# EAGLE schematic TheRightHandPath (EAGLE 9.6.0)

## Sheet 1 of 2
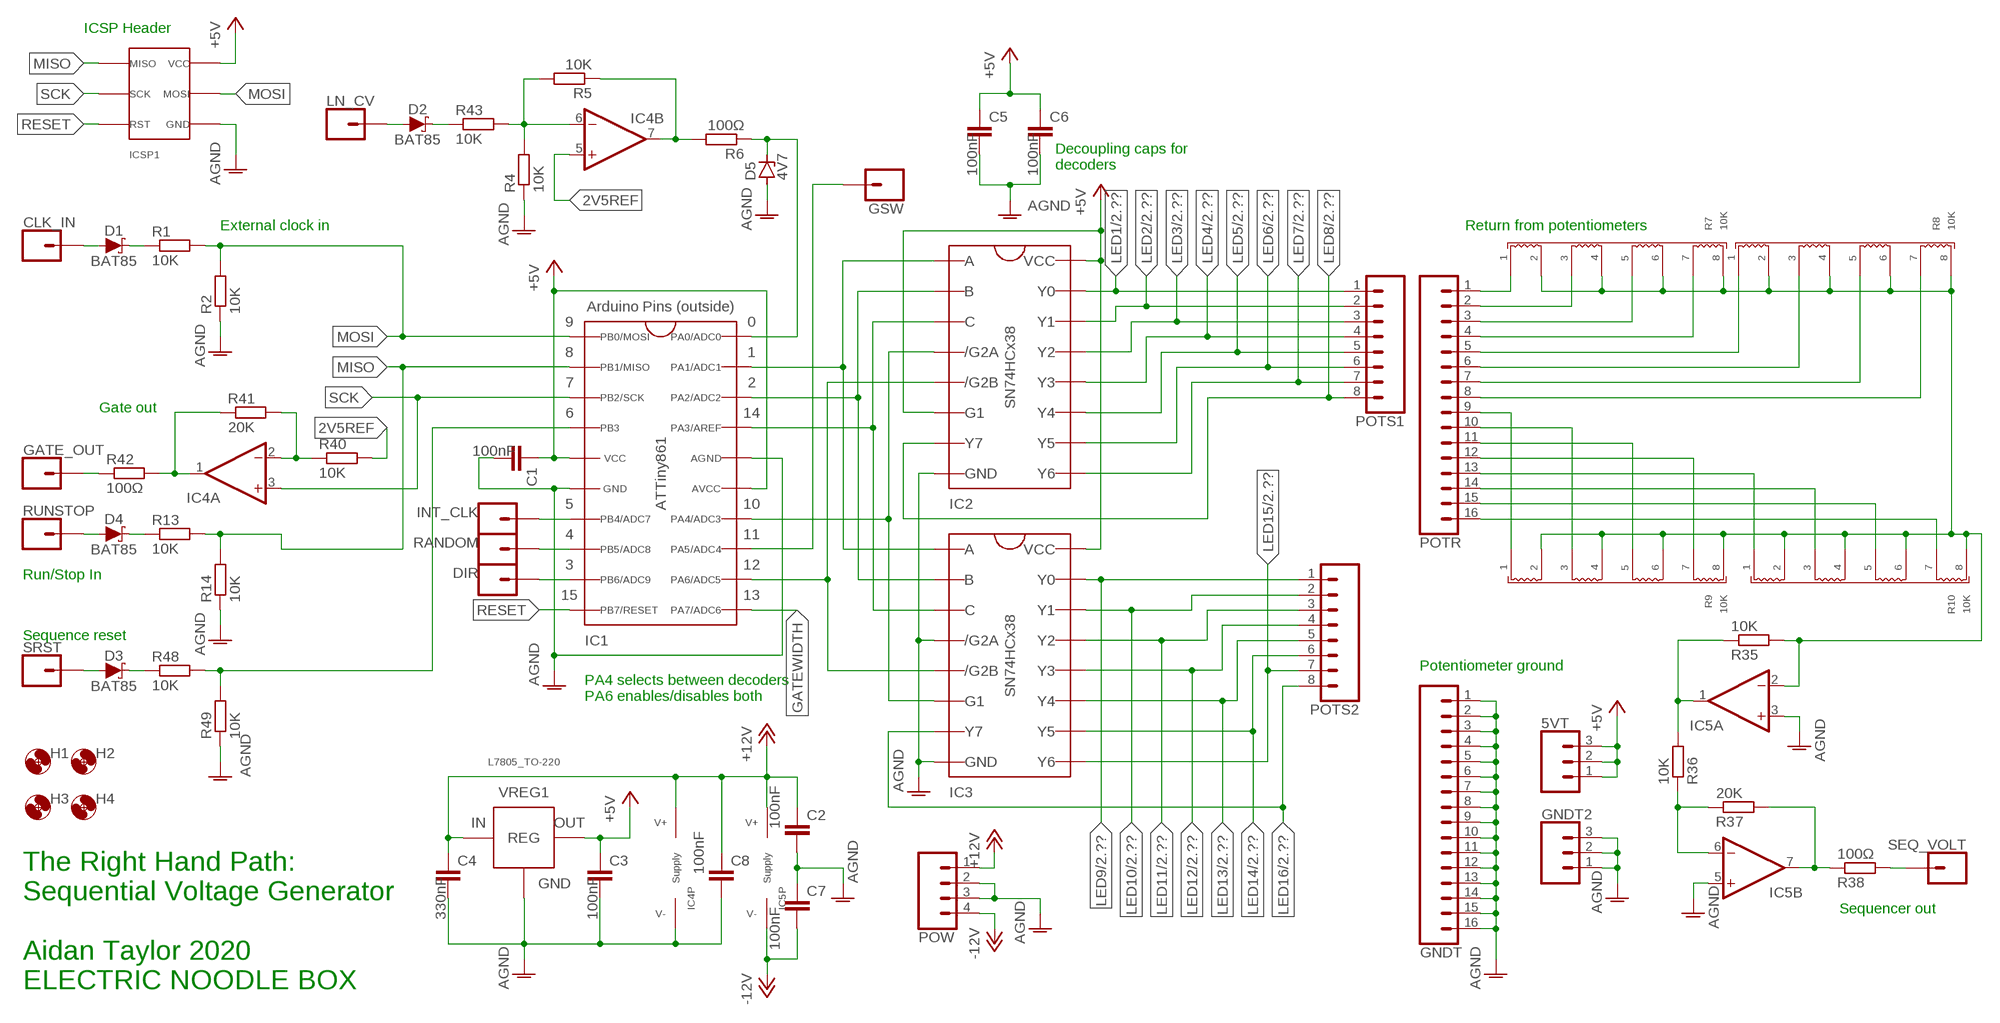
[diagram p0: schematic, sheet 1]

### Parts
5VT  3XWIREPAD  [1X03]
C1  100nF  C-EU050-025X075  [C050-025X075]
C2  100nF  C-EU050-025X075  [C050-025X075]
C3  100nF  C-EU050-025X075  [C050-025X075]
C4  330nF  C-EU050-025X075  [C050-025X075]
C5  100nF  C-EU050-025X075  [C050-025X075]
C6  100nF  C-EU050-025X075  [C050-025X075]
C7  100nF  C-EU050-025X075  [C050-025X075]
C8  100nF  C-EU050-025X075  [C050-025X075]
CLK_IN  1XWIREPAD  [1X01]
D1  BAT85  SCHOTTKY_DO35  [DO35-7]
D2  BAT85  SCHOTTKY_DO35  [DO35-7]
D3  BAT85  SCHOTTKY_DO35  [DO35-7]
D4  BAT85  SCHOTTKY_DO35  [DO35-7]
D5  4V7  ZENER-DIODEDO35Z10  [DO35Z10]
DIR  1XWIREPAD  [1X01]
GATE_OUT  1XWIREPAD  [1X01]
GNDT  16XWIREPAD  [1X16]
GNDT2  3XWIREPAD  [1X03]
GSW  1XWIREPAD  [1X01]
H1  MOUNT-HOLE3.2  [3,2]
H2  MOUNT-HOLE3.2  [3,2]
H3  MOUNT-HOLE3.2  [3,2]
H4  MOUNT-HOLE3.2  [3,2]
IC1  ATTINY861_DIP  [DIL20]
IC2  SN74HCX38  [DIL16]
IC3  SN74HCX38  [DIL16]
IC4  LM358_DIP  [DIL08]
IC5  TL0X2_DIP  [DIL08]
ICSP1  ICSP_2.54  [2X3]
INT_CLK  1XWIREPAD  [1X01]
LN_CV  1XWIREPAD  [1X01]
POTR  16XWIREPAD  [1X16]
POTS1  8XWIREPAD  [1X08]
POTS2  8XWIREPAD  [1X08]
POW  4XMOLEX  [MOLEX-1X4]
R1  10K  R-EU_0207/10  [0207/10]
R2  10K  R-EU_0207/10  [0207/10]
R4  10K  R-EU_0207/10  [0207/10]
R5  10K  R-EU_0207/10  [0207/10]
R6  100Ω  R-EU_0207/10  [0207/10]
R7  10K  4XISO_RESISTOR_NETWORK_2.54  [4_ISO_RES_NET_2.54]
R8  10K  4XISO_RESISTOR_NETWORK_2.54  [4_ISO_RES_NET_2.54]
R9  10K  4XISO_RESISTOR_NETWORK_2.54  [4_ISO_RES_NET_2.54]
R10  10K  4XISO_RESISTOR_NETWORK_2.54  [4_ISO_RES_NET_2.54]
R13  10K  R-EU_0207/10  [0207/10]
R14  10K  R-EU_0207/10  [0207/10]
R35  10K  R-EU_0207/10  [0207/10]
R36  10K  R-EU_0207/10  [0207/10]
R37  20K  R-EU_0207/10  [0207/10]
R38  100Ω  R-EU_0207/10  [0207/10]
R40  10K  R-EU_0207/10  [0207/10]
R41  20K  R-EU_0207/10  [0207/10]
R42  100Ω  R-EU_0207/10  [0207/10]
R43  10K  R-EU_0207/10  [0207/10]
R48  10K  R-EU_0207/10  [0207/10]
R49  10K  R-EU_0207/10  [0207/10]
RANDOM  1XWIREPAD  [1X01]
RUNSTOP  1XWIREPAD  [1X01]
SEQ_VOLT  1XWIREPAD  [1X01]
SRST  1XWIREPAD  [1X01]
VREG1  L7805_TO-220  [TO220H]

### Nets
2V5REF: IC4.5(B:+IN) R40.2
+5V: 5VT.1 5VT.2 5VT.3 C1.1 C3.1 C5.1 C6.1 IC1.5(VCC) IC1.15(AVCC) IC2.6(6_G1) IC2.16(16_VCC) IC3.16(16_VCC) ICSP1.2(6VCC) VREG1.3(VOUT) ; also sheet 2
+12V: C2.1 C4.1 C8.1 IC4.8(P:V+) IC5.8(P:V+) POW.1 VREG1.1(VIN)
-12V: C7.2 IC5.4(P:V-) POW.4
AGND: C1.2 C2.2 C3.2 C4.2 C5.2 C6.2 C7.1 C8.2 D5.A GNDT2.1 GNDT2.2 GNDT2.3 GNDT.1 GNDT.2 GNDT.3 GNDT.4 GNDT.5 GNDT.6 GNDT.7 GNDT.8 GNDT.9 GNDT.10 GNDT.11 GNDT.12 GNDT.13 GNDT.14 GNDT.15 GNDT.16 IC1.6(GND) IC1.16(AGND) IC2.8(8_GND) IC3.4(4_/G2A) IC3.8(8_GND) IC4.4(P:V-) IC5.3(A:+IN) IC5.5(B:+IN) ICSP1.6(4GND) POW.2 POW.3 R2.1 R4.1 R14.1 R49.1 VREG1.2(GND) ; also sheet 2
GATEWIDTH: IC1.11(11_PA7)
LED1: IC2.15(15_Y0) POTS1.1 ; also sheet 2
LED2: IC2.14(14_Y1) POTS1.2 ; also sheet 2
LED3: IC2.13(13_Y2) POTS1.3 ; also sheet 2
LED4: IC2.12(12_Y3) POTS1.4 ; also sheet 2
LED5: IC2.11(11_Y4) POTS1.5 ; also sheet 2
LED6: IC2.10(10_Y5) POTS1.6 ; also sheet 2
LED7: IC2.9(9_Y6) POTS1.7 ; also sheet 2
LED8: IC2.7(7_Y7) POTS1.8 ; also sheet 2
LED9: IC3.15(15_Y0) POTS2.1 ; also sheet 2
LED10: IC3.14(14_Y1) POTS2.2 ; also sheet 2
LED11: IC3.13(13_Y2) POTS2.3 ; also sheet 2
LED12: IC3.12(12_Y3) POTS2.4 ; also sheet 2
LED13: IC3.11(11_Y4) POTS2.5 ; also sheet 2
LED14: IC3.10(10_Y5) POTS2.6 ; also sheet 2
LED15: IC3.9(9_Y6) POTS2.7 ; also sheet 2
LED16: IC3.7(7_Y7) POTS2.8 ; also sheet 2
MISO: IC1.2(2_PB1) ICSP1.1(1MISO) R13.2 R14.2
MOSI: IC1.1(1_PB0) ICSP1.4(5MOSI) R1.2 R2.2
N$1: IC1.14(14_PA4) IC2.4(4_/G2A) IC3.6(6_G1)
N$2: IC1.17(17_PA3) IC2.3(3_C) IC3.3(3_C)
N$3: IC1.18(18_PA2) IC2.2(2_B) IC3.2(2_B)
N$4: IC1.19(19_PA1) IC2.1(1_A) IC3.1(1_A)
N$5: D4.A RUNSTOP.1
N$6: GSW.1 IC1.13(13_PA5)
N$8: CLK_IN.1 D1.A
N$9: D1.C R1.1
N$11: IC1.7(7_PB4) INT_CLK.1
N$13: IC1.12(12_PA6) IC2.5(5_/G2B) IC3.5(5_/G2B)
N$15: IC4.7(B:OUT) R5.1 R6.2
N$17: D5.C IC1.20(20_PA0) R6.1
N$42: POTR.1 R7.P$1
N$43: POTR.2 R7.P$3
N$44: POTR.3 R7.P$5
N$45: POTR.4 R7.P$7
N$46: POTR.5 R8.P$1
N$47: POTR.6 R8.P$3
N$48: POTR.7 R8.P$5
N$49: POTR.8 R8.P$7
N$50: POTR.9 R9.P$1
N$51: POTR.10 R9.P$3
N$52: POTR.11 R9.P$5
N$53: POTR.12 R9.P$7
N$54: POTR.13 R10.P$1
N$55: POTR.14 R10.P$3
N$56: POTR.15 R10.P$5
N$57: POTR.16 R10.P$7
N$58: IC5.2(A:-IN) R7.P$2 R7.P$4 R7.P$6 R7.P$8 R8.P$2 R8.P$4 R8.P$6 R8.P$8 R9.P$2 R9.P$4 R9.P$6 R9.P$8 R10.P$2 R10.P$4 R10.P$6 R10.P$8 R35.2
N$59: IC5.1(A:OUT) R35.1 R36.2
N$60: IC5.6(B:-IN) R36.1 R37.1
N$61: R38.2 SEQ_VOLT.1
N$62: IC5.7(B:OUT) R37.2 R38.1
N$63: IC4.2(A:-IN) R40.1 R41.2
N$64: GATE_OUT.1 R42.1
N$65: IC4.1(A:OUT) R41.1 R42.2
N$66: D2.C R43.1
N$67: IC4.6(B:-IN) R4.2 R5.2 R43.2
N$71: D2.A LN_CV.1
N$73: IC1.8(8_PB5) RANDOM.1
N$74: DIR.1 IC1.9(9_PB6)
N$75: D3.A SRST.1
N$76: D3.C R48.1
N$77: IC1.4(4_PB3) R48.2 R49.2
N$80: D4.C R13.1
RESET: IC1.10(10_PB7) ICSP1.5(3RST)
SCK: IC1.3(3_PB2) IC4.3(A:+IN) ICSP1.3(2SCK)

### Notes on the sheet
- ICSP Header
- Decoupling caps for
  decoders
- External clock in | Return from potentiometers
- Gate out
- Run/Stop In
- Sequence reset
- Potentiometer ground
- PA4 selects between decoders
  PA6 enables/disables both
- Sequencer out
- The Right Hand Path:
  Sequential Voltage Generator
  
  Aidan Taylor 2020
  ELECTRIC NOODLE BOX

## Sheet 2 of 2
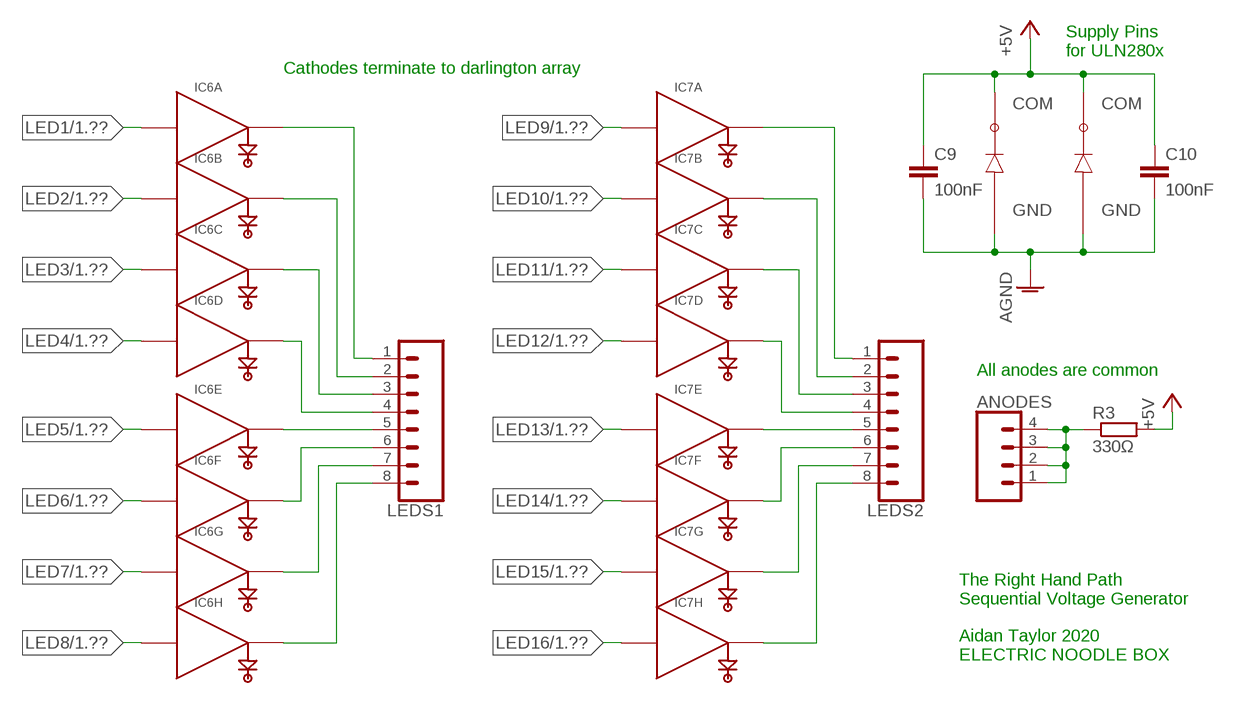
[diagram p1: schematic, sheet 2]

### Parts
ANODES  4XWIREPAD  [1X04]
C9  100nF  C-EU050-025X075  [C050-025X075]
C10  100nF  C-EU050-025X075  [C050-025X075]
IC6  ULN2801_DIP  [DIL18]
IC7  ULN2801_DIP  [DIL18]
LEDS1  8XWIREPAD  [1X08]
LEDS2  8XWIREPAD  [1X08]
R3  330Ω  R-EU_0207/10  [0207/10]

### Nets
+5V: C9.1 C10.1 IC6.10(COM) IC7.10(COM) R3.2 ; also sheet 1
AGND: C9.2 C10.2 IC6.9(GND) IC7.9(GND) ; also sheet 1
LED1: IC6.1(A:IN) ; also sheet 1
LED2: IC6.2(B:IN) ; also sheet 1
LED3: IC6.3(C:IN) ; also sheet 1
LED4: IC6.4(D:IN) ; also sheet 1
LED5: IC6.5(E:IN) ; also sheet 1
LED6: IC6.6(F:IN) ; also sheet 1
LED7: IC6.7(G:IN) ; also sheet 1
LED8: IC6.8(H:IN) ; also sheet 1
LED9: IC7.1(A:IN) ; also sheet 1
LED10: IC7.2(B:IN) ; also sheet 1
LED11: IC7.3(C:IN) ; also sheet 1
LED12: IC7.4(D:IN) ; also sheet 1
LED13: IC7.5(E:IN) ; also sheet 1
LED14: IC7.6(F:IN) ; also sheet 1
LED15: IC7.7(G:IN) ; also sheet 1
LED16: IC7.8(H:IN) ; also sheet 1
N$7: ANODES.1 ANODES.2 ANODES.3 ANODES.4 R3.1
N$10: IC6.18 LEDS1.1
N$12: IC6.17 LEDS1.2
N$14: IC6.16 LEDS1.3
N$16: IC6.15 LEDS1.4
N$18: IC6.14 LEDS1.5
N$20: IC6.13 LEDS1.6
N$22: IC6.12 LEDS1.7
N$24: IC6.11 LEDS1.8
N$26: IC7.18 LEDS2.1
N$28: IC7.17 LEDS2.2
N$30: IC7.16 LEDS2.3
N$32: IC7.15 LEDS2.4
N$34: IC7.14 LEDS2.5
N$36: IC7.13 LEDS2.6
N$38: IC7.12 LEDS2.7
N$40: IC7.11 LEDS2.8

### Notes on the sheet
- Supply Pins
  for ULN280x
- Cathodes terminate to darlington array
- All anodes are common
- The Right Hand Path
  Sequential Voltage Generator
  
  Aidan Taylor 2020
  ELECTRIC NOODLE BOX

## Library data of the parts
5VT GNDT2 = ElectricNoodleBox:3XWIREPAD
ANODES = ElectricNoodleBox:4XWIREPAD
C1-C10 = rcl:C-EU: CAPACITOR, European symbol; SPICEPREFIX: C
CLK_IN DIR GATE_OUT GSW INT_CLK LN_CV RANDOM RUNSTOP SEQ_VOLT SRST = ElectricNoodleBox:1XWIREPAD
D1-D4 = ElectricNoodleBox:SCHOTTKY_DO35
D5 = diode:ZENER-DIODE: Z-Diode
GNDT POTR = ElectricNoodleBox:16XWIREPAD
H1-H4 = holes:MOUNT-HOLE: MOUNTING HOLE with drill center marker
IC1 = ElectricNoodleBox:ATTINY861_DIP
IC2 IC3 = ElectricNoodleBox:SN74HCX38
IC4 = ElectricNoodleBox:LM358_DIP
IC5 = ElectricNoodleBox:TL0X2_DIP
IC6 IC7 = ElectricNoodleBox:ULN2801_DIP
ICSP1 = ElectricNoodleBox:ICSP_2.54
LEDS1 LEDS2 POTS1 POTS2 = ElectricNoodleBox:8XWIREPAD
POW = ElectricNoodleBox:4XMOLEX
R1-R6 R13 R14 R35-R38 R40-R43 R48 R49 = rcl:R-EU_: RESISTOR, European symbol; SPICEPREFIX: R
R7-R10 = ElectricNoodleBox:4XISO_RESISTOR_NETWORK_2.54
VREG1 = ElectricNoodleBox:L7805_TO-220